# EAGLE design BatteryManagement (EAGLE 6.0)
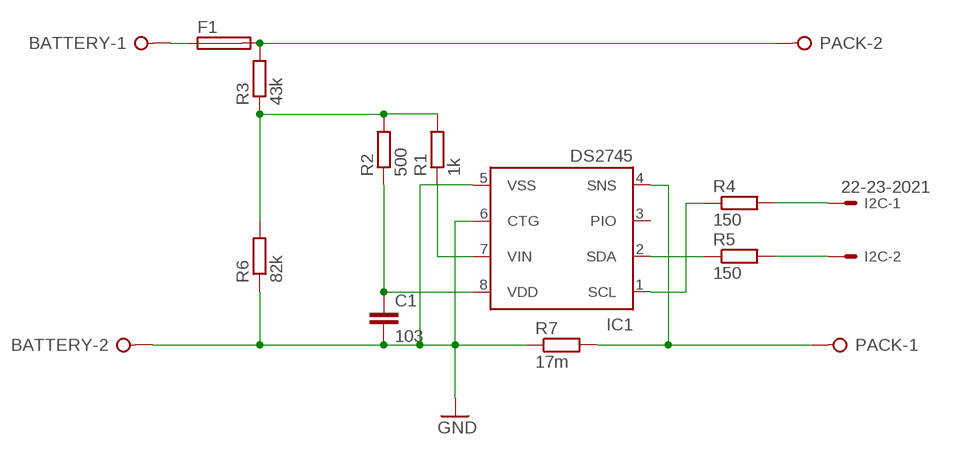
[diagram p0: schematic, sheet 1]

## Parts
BATTERY  W237-02P  [W237-132]
C1  103  C-EU050-030X075  [C050-030X075]
F1  SH22,5  [SH22,5]
I2C  22-23-2021  [22-23-2021]
IC1  DS2745  [UMAX10]
PACK  W237-02P  [W237-132]
R1  1k  R-EU_0207/10  [0207/10]
R2  500  R-EU_0207/10  [0207/10]
R3  43k  R-EU_0207/10  [0207/10]
R4  150  R-EU_0207/10  [0207/10]
R5  150  R-EU_0207/10  [0207/10]
R6  82k  R-EU_0207/10  [0207/10]
R7  17m  R-EU_M1206  [M1206]

## Nets
GND: BATTERY.2 C1.2 IC1.5(VSS) IC1.6(CTG) R6.1 R7.1
N$1: I2C.1 R4.2
N$2: I2C.2 R5.2
N$3: IC1.1(SCL) R4.1
N$4: IC1.2(SDA) R5.1
N$5: BATTERY.1 F1.1
N$6: IC1.7(VIN) R1.1
N$7: C1.1 IC1.8(VDD) R2.1
N$8: IC1.4(SNS) PACK.1 R7.2
N$9: F1.2 PACK.2 R3.2
N$10: R1.2 R2.2 R3.1 R6.2
Unconnected: IC1.3(PIO)

## Library data of the parts
BATTERY PACK = con-wago-508:W237-02P: WAGO SREW CLAMP; OC_FARNELL: unknown; OC_NEWARK: unknown
C1 = rcl:C-EU: CAPACITOR, European symbol
F1 = fuse:SH22,5: FUSE HOLDER grid 22,5 mm, OGN0031 8201, Schurter (Buerklin); MF: SCHURTER; MPN: 0031.8201; OC_FARNELL: 1162740; OC_NEWARK: 96F8317
I2C = con-molex:22-23-2021: .100" (2.54mm) Center Header - 2 Pin; MF: MOLEX; MPN: 22-23-2021; OC_FARNELL: 1462926; OC_NEWARK: 25C3832
IC1 = DS2745:DS2745: Low-Cost I²C Battery Monitor in µMAX Source: http://www.maxim-ic.com .. DS2745.pdf
R1-R7 = rcl:R-EU_: RESISTOR, European symbol

## Board
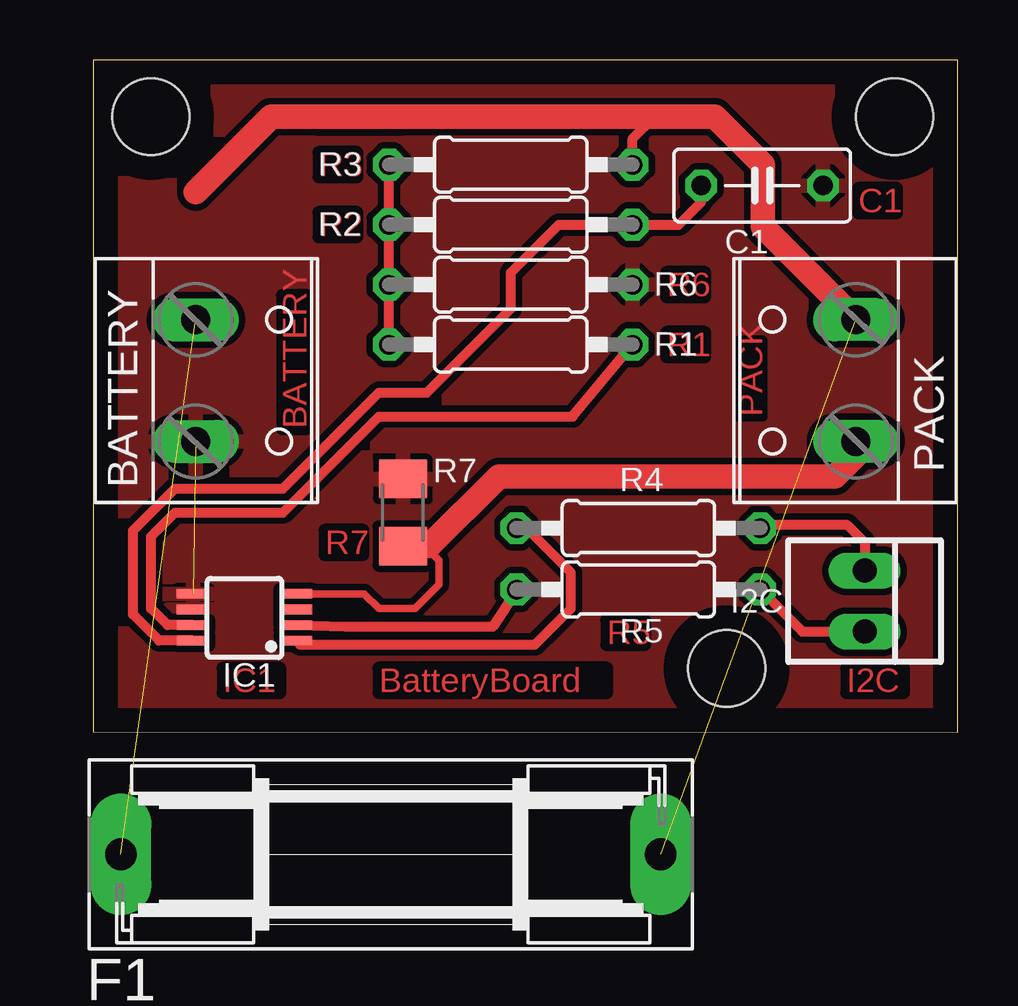
[diagram p1: board, top side]

Size 36.03 x 28.03 mm. Coordinates in mm from the lower left corner, seen from the top.
Outline: 0,0.01 36.03,0 36.03,28.02 0,28.03 0,0.01
Copper layers (1*16): Top 0.035mm / dielectric 1.5mm / Bottom 0.035mm
Design rules: minimum track width 10mil, minimum drill 24mil, track to track 8mil, track to pad 8mil, pad to pad 8mil, via to via 8mil, smd to smd 8mil, copper to edge 40mil, drill to drill 8mil, minimum pad ring 10mil, minimum via ring 8mil, stop-mask expansion 4mil, vias tented up to drill 0mil, thermal gap 10mil
Holes 3.2 mm at 2.4,25.66 33.4,25.66 26.4,2.67

### Footprints (pad centres in the part's own frame; a part is rotated, then mirrored left to right if it is on the bottom)
W237-132 = drill 1.194 long: 1 -2.54,-0.635; 2 2.54,-0.635
C050-030X075 = drill 0.813 octagon: 1 -2.54,0; 2 2.54,0
SH22,5 = drill 1.321 pad 2.54 long: 1 -11.252,0; 2 11.252,0
22-23-2021 = drill 1 long: 1 -1.27,0; 2 1.27,0
UMAX10 = smd 1.35 x 0.4: 1 1.7,-0.65; 2 1.7,0; 3 1.7,0.65; 4 1.7,1.3; 5 -2.6,1.3; 6 -2.6,0.65; 7 -2.6,0; 8 -2.6,-0.65
0207/10 = drill 0.813 octagon: 1 -5.08,0; 2 5.08,0
M1206 = smd 1.6 x 2: 1 -1.4,0; 2 1.4,0

### Placement (x,y rotation side)
BATTERY  4.9,14.66 270 top
C1  27.88,22.79 0 top
F1  12.4,-5.08 0 top  (outside the outline)
I2C  32.15,5.47 270 top
IC1  6.75,4.47 0 top
PACK  31.15,14.66 90 top
R1  17.4,16.16 180 top
R2  17.4,21.16 180 top
R3  17.4,23.66 0 top
R4  22.72,8.51 0 top
R5  22.72,5.96 0 top
R6  17.4,18.66 180 top
R7  12.9,9.16 270 top

### Tracks (layer width: path | path; a pad name or v marks a point on that pad's centre or on a via)
GND  (1 unrouted)
  pour Top (isolate 0.27): -0.6,29.16 -0.6,-0.34 36.4,-0.34 36.4,29.16
  pour Top (isolate 0.27, no thermals): 11.4,0.67 22.9,0.67 22.9,3.67 11.4,3.67
N$1
  Top 0.406: R4.2 27.95,8.66 31.4,8.66 32.15,7.92 I2C.1
N$2
  Top 0.406: R5.2 29.55,4.21 I2C.2
N$3
  Top 0.406: IC1.1 8.61,3.67 18.4,3.67 19.9,5.17 19.9,6.67 18.05,8.51 R4.1
N$4
  Top 0.406: IC1.2 10.51,4.42 16.65,4.42 17.64,5.91 R5.1
N$5  (1 unrouted)
  pour Top (isolate 0.27): 0.9,4.42 14.4,4.42 14.4,0.67 0.9,0.67
N$6
  Top 0.406: IC1.7 3.09,4.47 2.4,5.17 2.4,8.16 3.4,9.16 7.9,9.16 11.9,13.16 19.98,13.16 R1.1
N$7
  Top 0.406: IC1.8 2.74,3.83 1.65,4.92 1.65,8.41 3.4,10.16 7.9,10.16 11.9,14.16 13.9,14.16 17.4,17.66 17.4,19.16 19.4,21.16 R2.1 24.4,21.16 25.34,22.11 C1.1
N$8
  Top 0.305: IC1.4 11.29,5.78 11.9,5.17 13.4,5.17 14.4,6.17 14.4,7.17 14,7.57 14,7.76 | 13.4,8.16 12.9,7.67 R7.2
  Top 1.016: R7.2 14,7.76 16.9,10.66 30.9,10.66 31.79,11.55 PACK.1
N$9  (1 unrouted)
  Top 0.406: 24.4,25.59 24.4,25.66 | R3.2 22.48,24.74 23.4,25.66
  Top 1.016: 4.27,22.53 7.4,25.66 23.4,25.66 24.4,25.66 25.9,25.66 27.9,23.66 27.9,21.09 PACK.2
N$10
  Top 0.406: R1.2 R6.2 R2.2 R3.1
N$11
  pour Top (isolate 0.27): 27.9,4.67 34.4,4.67 34.4,0.67 27.9,0.67
N$12
  pour Top (isolate 0.27): 11.9,10.66 31.9,10.66 32.9,0.67 11.4,1.17
N$13
  pour Top (isolate 0.27): 22.9,20.16 25.9,20.16 25.9,14.66 22.9,14.66
N$14
  pour Top: 25.9,17.16 28.9,17.16 28.9,12.66 25.9,12.66
N$15
  pour Top (isolate 0.27): 30.9,24.16 35.4,24.16 35.4,20.66 30.9,20.66
N$16
  pour Top (isolate 0.27): 8.9,25.16 12.9,25.16 12.9,20.16 8.9,20.16
N$17
  pour Top (isolate 0.27): 6.9,19.66 9.9,19.66 9.9,11.66 6.9,11.66
N$18
  pour Top (isolate 0.27): 11.65,9.16 11.65,6.67 8.9,6.67 8.9,9.16

### Text on the board
Top: R3 | C1 | R2 | R6 | R1 | BATTERY | PACK | R7 | R5 | IC1 | BatteryBoard | I2C
tRestrict: R3 | C1 | R2 | R6 | R1 | BATTERY | PACK | R7 | R5 | IC1 | BatteryBoard | I2C